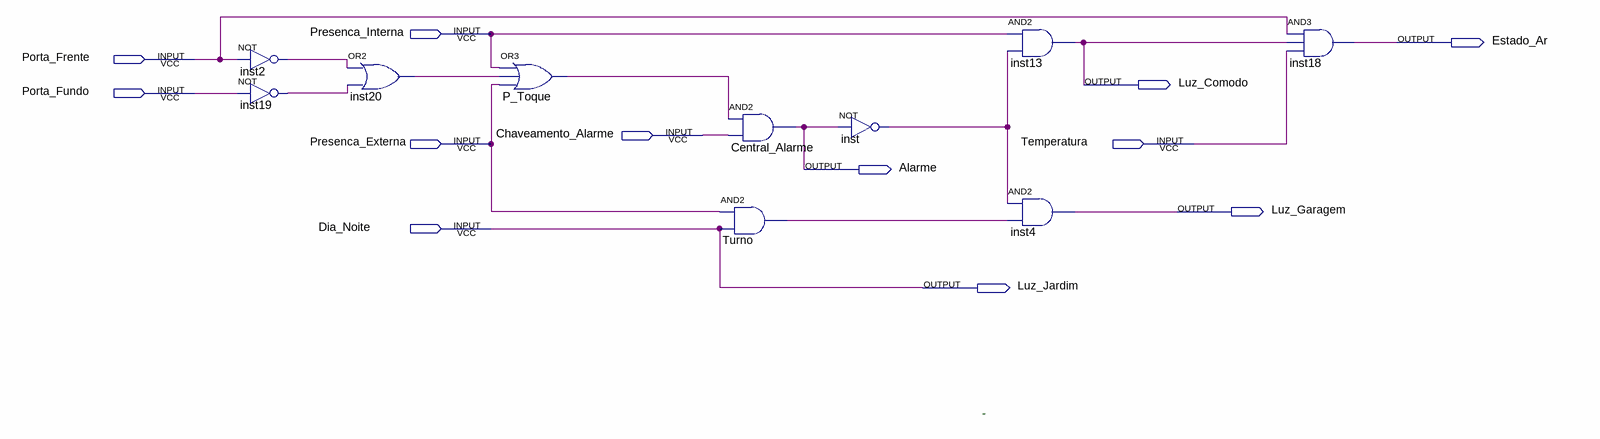
[diagram p0: schematic sheet]
// Quartus schematic PBL01CD.bdf as structural Verilog: 10 symbols, 12 pins
module PBL01CD (
  input  Presenca_Interna,
  input  Porta_Frente,
  input  Porta_Fundo,
  input  Chaveamento_Alarme,
  input  Presenca_Externa,
  input  Temperatura,
  input  Dia_Noite,
  output Estado_Ar,
  output Luz_Comodo,
  output Alarme,
  output Luz_Garagem,
  output Luz_Jardim
);

  wire inst2_out, inst19_out, inst20_out, inst_out, P_Toque_out, Turno_out;

  not inst2 (inst2_out, Porta_Frente);
  not inst19 (inst19_out, Porta_Fundo);
  or inst20 (inst20_out, inst2_out, inst19_out);
  or P_Toque (P_Toque_out, Presenca_Interna, inst20_out, Presenca_Externa);
  and Central_Alarme (Alarme, P_Toque_out, Chaveamento_Alarme);
  and Turno (Turno_out, Presenca_Externa, Dia_Noite);
  not inst (inst_out, Alarme);
  and inst13 (Luz_Comodo, Presenca_Interna, inst_out);
  and inst4 (Luz_Garagem, inst_out, Turno_out);
  and inst18 (Estado_Ar, Porta_Frente, Luz_Comodo, Temperatura);

  assign Luz_Jardim = Dia_Noite;

  // Notes on the sheet:
  //   -
endmodule
